# Altium schematic sheet Mechanical.SchDoc
size A4; SheetNumber: 2; SheetTotal: 3
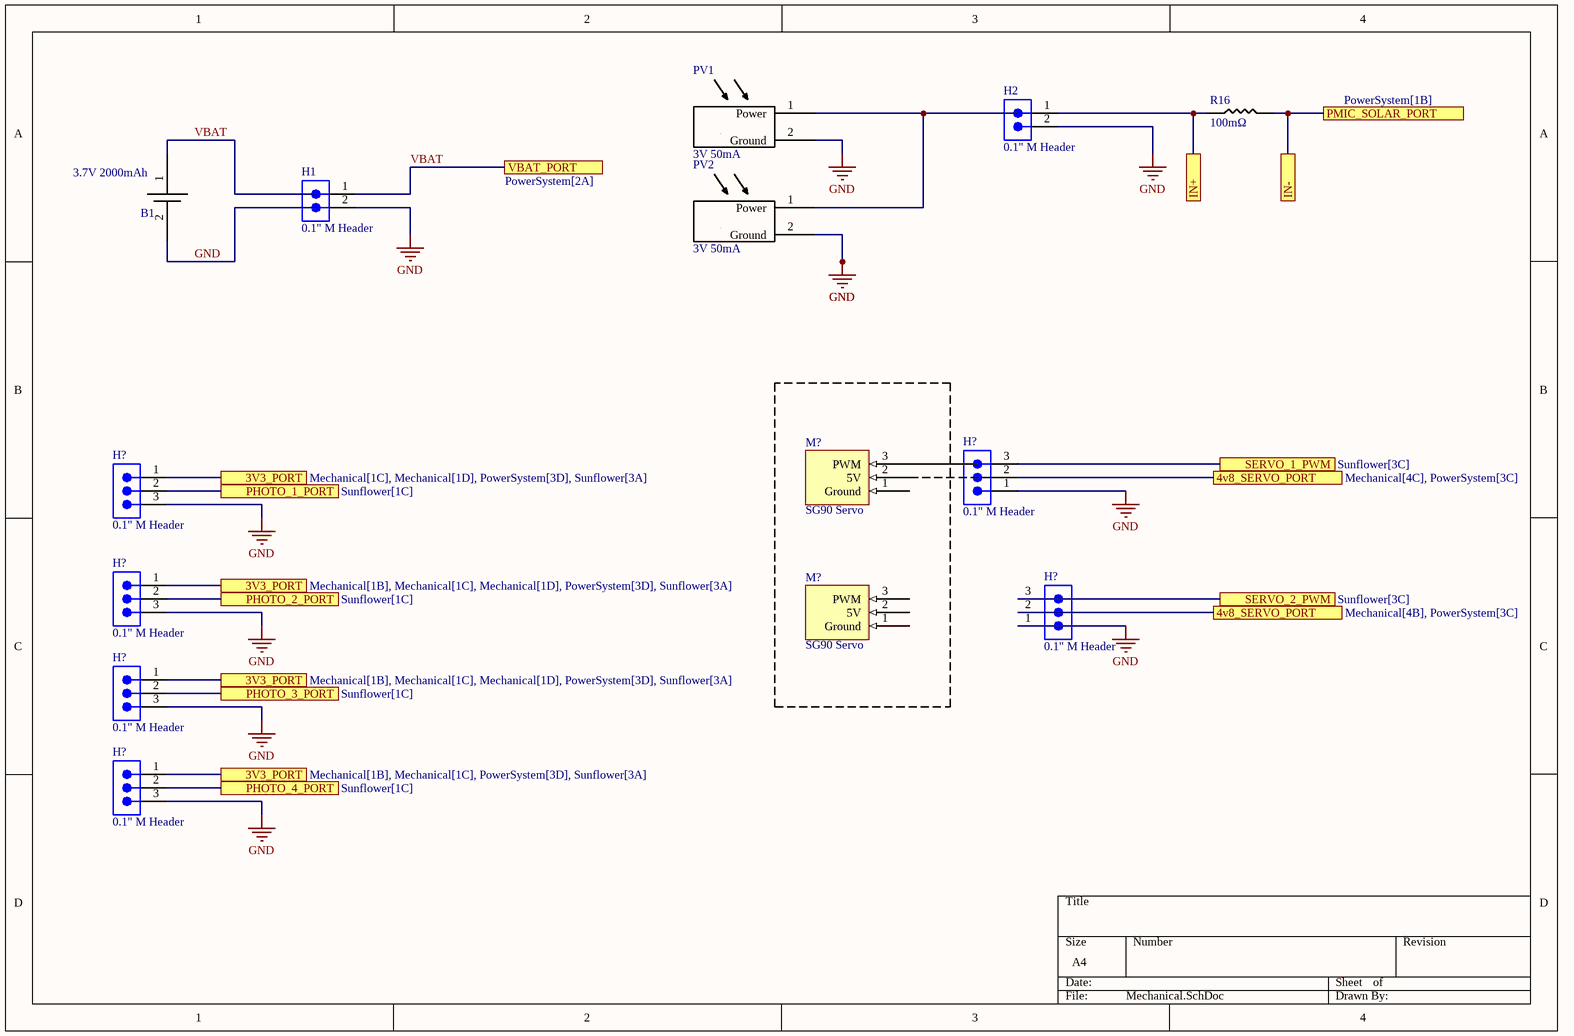
[diagram p0: Mechanical.SchDoc]

## Parts
(Parts that share a designator on the sheet are numbered #1, #2 ... from top to bottom, then left to right.)
B1  3.7V 2000mAh  [2_PIN_100MIL_BATTERY]
H1  0.1" M Header  [2_PIN_100MIL]
H2  0.1" M Header  [2_PIN_100MIL]
H?#1  0.1" M Header  [3_PIN_100mil_SERVO]
H?#2  0.1" M Header  [3_PIN_100mil_Photodiode]
H?#3  0.1" M Header  [3_PIN_100mil_Photodiode]
H?#4  0.1" M Header  [3_PIN_100mil_SERVO]
H?#5  0.1" M Header  [3_PIN_100mil_Photodiode]
H?#6  0.1" M Header  [3_PIN_100mil_Photodiode]
M?#1  SG90 Servo  [3_PIN_100mil_SERVO]  (mechanical)
M?#2  SG90 Servo  [3_PIN_100mil_SERVO]  (mechanical)
PV1  3V 50mA  [2_PIN_100MIL_SOLAR]
PV2  3V 50mA  [2_PIN_100MIL_SOLAR]
R16  value 100mΩ  [0603_Resistor]  (hidden comment: 0.1Ohm)

## Ports
3V3_PORT (see Mechanical[1B], Mechanical[1C], Mechanical[1D], PowerSystem[3D], Sunflower[3A]), 3V3_PORT (see Mechanical[1B], Mechanical[1C], PowerSystem[3D], Sunflower[3A]), 3V3_PORT (see Mechanical[1C], Mechanical[1D], PowerSystem[3D], Sunflower[3A]), 4v8_SERVO_PORT (see Mechanical[4B], PowerSystem[3C]), 4v8_SERVO_PORT (see Mechanical[4C], PowerSystem[3C]), IN+, IN-, PHOTO_1_PORT (see Sunflower[1C]), PHOTO_2_PORT (see Sunflower[1C]), PHOTO_3_PORT (see Sunflower[1C]), PHOTO_4_PORT (see Sunflower[1C]), PMIC_SOLAR_PORT (see PowerSystem[1B]), SERVO_1_PWM (see Sunflower[3C]), SERVO_2_PWM (see Sunflower[3C]), VBAT_PORT (see PowerSystem[2A])

## Nets
GND: B1.2(Ground) H1.2 H2.2 H?#1.1(PWM) H?#2.3 H?#3.3 H?#4.1(PWM) H?#5.3 H?#6.3 PV1.2(Ground) PV2.2(Ground)
3V3_PORT: H?#2.1 H?#3.1 H?#5.1 H?#6.1 ; port 3V3_PORT
4v8_SERVO_PORT: H?#1.2(Power) H?#4.2(Power) ; port 4v8_SERVO_PORT
IN+: H2.1 R16.1 ; port IN+
IN-: R16.2 ; port PMIC_SOLAR_PORT, port IN-
PHOTO_1_PORT: H?#2.2 ; port PHOTO_1_PORT
PHOTO_2_PORT: H?#3.2 ; port PHOTO_2_PORT
PHOTO_3_PORT: H?#5.2 ; port PHOTO_3_PORT
PHOTO_4_PORT: H?#6.2 ; port PHOTO_4_PORT
SERVO_1_PWM: H?#1.3(Ground) ; port SERVO_1_PWM
SERVO_2_PWM: H?#4.3(Ground) ; port SERVO_2_PWM
VBAT: B1.1(Power) H1.1 ; port VBAT_PORT
NetPV1_1: PV1.1(Power) PV2.1(Power)

Not connected (* = marked no-connect by the designer): M?#1 1(Ground) 2(5V) 3(PWM); M?#2 1(Ground) 2(5V) 3(PWM)

## Library data of the parts
B1 = 2011_Battery: Lithium Ion Battery - 3.7V 2000Mah Adafruit 2011; Manufacturer: Adafruit Industries; Manufacturer Part Number: 2011; Supplier: DigiKey; Supplier Part Number: 1528-1857-ND; Category: Batteries and Accessories; Stock: 51; Pricing: 1=12.5 (USD); RoHS: Non-Compliant; Schedule B: 8507600000|8507600000|8507600000|8507600000|8507600000
H1 = Battery_2Pin_100mil: CONN HEADER VERT 2POS 2.54MM; Manufacturer: Sullins; Manufacturer Part Number: PRPC002SAAN-RC; Connector Type: Header, Unshrouded, Breakaway; Number of Positions: 2; Number of Positions Loaded: All; Pitch: 0.100" (2.54mm); Online Catalog: 0.100" (2.54mm) Pitch Connector Headers; Other Names: S9510E-02  S9510E-02-ND; Supplier 1: Digi-Key; Stock 1: 42739; Pricing 1: 1=0.08, 10=0.073, 25=0.054, 50=0.0464, 100=0.0449, 250=0.0387, 500=0.0372 (USD); Standard Package: 1; Category: Connectors, Interconnects; Family: Rectangular Connectors - Headers, Male Pins; Series: -; Packaging: Bulk; Contact Type: Male Pin; Number of Rows: 1; Row Spacing: -; Contact Mating Length: 0.230" (5.84mm); Mounting Type: Through Hole; Termination: Solder; Fastening Type: -; Features: -; Contact Finish: Gold; Contact Finish Thickness: Flash; Color: Black; ComponentLink1URL: https://media.digikey.com/PDF/Data%20Sheets/Sullins%20PDFs/xRxCzzzSxxN-RC_ST_11635-B.pdf?src-supplier=Digi-Key; ComponentLink1Description: https://media.digikey.com/PDF/Data%20Sheets/Sullins%20PDFs/xRxCzzzSxxN-RC_ST_11635-B.pdf?src-supplier=Digi-Key; Supplier Part Number 1: S1011EC-02-ND
H2 = Solar_2Pin_100mil: CONN HEADER VERT 2POS 2.54MM; Manufacturer: Sullins; Manufacturer Part Number: PRPC002SAAN-RC; Connector Type: Header, Unshrouded, Breakaway; Number of Positions: 2; Number of Positions Loaded: All; Pitch: 0.100" (2.54mm); Online Catalog: 0.100" (2.54mm) Pitch Connector Headers; Other Names: S9510E-02  S9510E-02-ND; Supplier 1: Digi-Key; Stock 1: 42739; Pricing 1: 1=0.08, 10=0.073, 25=0.054, 50=0.0464, 100=0.0449, 250=0.0387, 500=0.0372 (USD); Standard Package: 1; Category: Connectors, Interconnects; Family: Rectangular Connectors - Headers, Male Pins; Series: -; Packaging: Bulk; Contact Type: Male Pin; Number of Rows: 1; Row Spacing: -; Contact Mating Length: 0.230" (5.84mm); Mounting Type: Through Hole; Termination: Solder; Fastening Type: -; Features: -; Contact Finish: Gold; Contact Finish Thickness: Flash; Color: Black; ComponentLink1URL: https://media.digikey.com/PDF/Data%20Sheets/Sullins%20PDFs/xRxCzzzSxxN-RC_ST_11635-B.pdf?src-supplier=Digi-Key; ComponentLink1Description: https://media.digikey.com/PDF/Data%20Sheets/Sullins%20PDFs/xRxCzzzSxxN-RC_ST_11635-B.pdf?src-supplier=Digi-Key; Supplier Part Number 1: S1011EC-02-ND
H?#1 H?#4 = Servo_3Pin_100mil: CONN HEADER VERT 3POS 2.54MM; Manufacturer: Sullins; Manufacturer Part Number: PRPC003SAAN-RC; Connector Type: Header, Unshrouded, Breakaway; Number of Positions: 3; Number of Positions Loaded: All; Pitch: 0.100" (2.54mm); Online Catalog: 0.100" (2.54mm) Pitch Connector Headers; Other Names: S9510E-03  S9510E-03-ND; Supplier 1: Digi-Key; Stock 1: 19067; Pricing 1: 1=0.12, 10=0.109, 25=0.0812, 50=0.0696, 100=0.0673, 250=0.058, 500=0.0557 (USD); Standard Package: 1; Category: Connectors, Interconnects; Family: Rectangular Connectors - Headers, Male Pins; Series: -; Packaging: Bulk; Contact Type: Male Pin; Number of Rows: 1; Row Spacing: -; Contact Mating Length: 0.230" (5.84mm); Mounting Type: Through Hole; Termination: Solder; Fastening Type: -; Features: -; Contact Finish: Gold; Contact Finish Thickness: Flash; Color: Black; ComponentLink1URL: https://media.digikey.com/PDF/Data%20Sheets/Sullins%20PDFs/xRxCzzzSxxN-RC_ST_11635-B.pdf?src-supplier=Digi-Key; ComponentLink1Description: https://media.digikey.com/PDF/Data%20Sheets/Sullins%20PDFs/xRxCzzzSxxN-RC_ST_11635-B.pdf?src-supplier=Digi-Key; Supplier Part Number 1: S1011EC-03-ND
H?#2 H?#3 H?#5 H?#6 = Photodiode_3Pin_100mil: CONN HEADER VERT 3POS 2.54MM; Manufacturer: Sullins; Manufacturer Part Number: PRPC003SAAN-RC; Connector Type: Header, Unshrouded, Breakaway; Number of Positions: 3; Number of Positions Loaded: All; Pitch: 0.100" (2.54mm); Online Catalog: 0.100" (2.54mm) Pitch Connector Headers; Other Names: S9510E-03  S9510E-03-ND; Supplier 1: Digi-Key; Stock 1: 19067; Pricing 1: 1=0.12, 10=0.109, 25=0.0812, 50=0.0696, 100=0.0673, 250=0.058, 500=0.0557 (USD); Standard Package: 1; Category: Connectors, Interconnects; Family: Rectangular Connectors - Headers, Male Pins; Series: -; Packaging: Bulk; Contact Type: Male Pin; Number of Rows: 1; Row Spacing: -; Contact Mating Length: 0.230" (5.84mm); Mounting Type: Through Hole; Termination: Solder; Fastening Type: -; Features: -; Contact Finish: Gold; Contact Finish Thickness: Flash; Color: Black; ComponentLink1URL: https://media.digikey.com/PDF/Data%20Sheets/Sullins%20PDFs/xRxCzzzSxxN-RC_ST_11635-B.pdf?src-supplier=Digi-Key; ComponentLink1Description: https://media.digikey.com/PDF/Data%20Sheets/Sullins%20PDFs/xRxCzzzSxxN-RC_ST_11635-B.pdf?src-supplier=Digi-Key; Supplier Part Number 1: S1011EC-03-ND
M?#1 M?#2 = SG90
PV1 PV2 = MP3-37: Flexible Thin Film Solar Module 3.0V @ 50mA; Manufacturer: PowerFilm; Supplier: DigiKey; Supplier Part Number: 1996-1024-ND; Manufacturer Part Number: MP3-37; Category: Sensors; Stock: 47; Pricing: 1=8.47, 10=6.927, 50=6.0358, 100=5.6918, 300=5.18977, 500=4.97292, 1000=4.69426 (USD); Case/Package: Module; RoHS: Non-Compliant; ComponentLink1URL: https://datasheet.octopart.com:443/MP3-37-PowerFilm-datasheet-13541941.pdf?src-supplier=Jameco+(USA); ComponentLink1Description: https://datasheet.octopart.com:443/MP3-37-PowerFilm-datasheet-13541941.pdf?src-supplier=Jameco+(USA)
R16 = R_0603_0.1Ohm: Res Thick Film 0603 0.1 Ohm 1% 0.25W ±300ppm/°C Molded SMD Punched Carrier T/R; Manufacturer: Panasonic; Manufacturer Part Number: ERJ3BSFR10V; Manufacturer Lifecycle Status: ACTIVE; Part Series: Current Sensing Resistors Thick Film Type; Max Power Dissipation: 250mW; Working Voltage: 158.1mV; Supplier: DigiKey; Supplier Part Number: P17447CT-ND; RoHS: Compliant; Category: Chip SMD Resistors; Stock: 26179; Pricing: 1=0.37, 10=0.204, 25=0.1668, 50=0.1458, 100=0.129, 250=0.11208, 500=0.1023, 1000=0.09455 (USD); Case/Package: 0603; Case Code (Imperial): 0603; Case Code (Metric): 1608; Composition: Thick Film; Contact Plating: Tin; Country of Origin: Japan; Depth: 800µm; Export Control Classification Number (ECCN) Code: EAR99; Features: Automotive AEC-Q200; Height: 450µm; Harmonized Tariff Schedule (HTS) Code: 8533.21.00.30; Introduction Date: 2006-01-31; Length: 1.6mm; Lifecycle Status: Production; Max Operating Temperature: 155°C; Military Standard: Not; Min Operating Temperature: -55°C; Mounting Technology: Surface Mount; Pins: 2; Number of Terminals: 2; Number of Terminations: 2; Packaging: Cut Tape; Power Rating: 250mW; Radiation Hardening: No; Ratings: AEC-Q200; REACH SVHC: Unaffected; Schedule B: 8533210045, 8533210045|8533210045, 8533210045|8533210045|8533210045, 8533210045|8533210045|8533210045|8533210045; Temperature Coefficient: 300ppm/°C; Termination: SMD/SMT; Tolerance: 1%; Width: 800µm; ComponentLink1URL: https://datasheet.octopart.com:443/ERJ3BSFR10V-Panasonic-datasheet-175421125.pdf?src-supplier=IHS; ComponentLink1Description: https://datasheet.octopart.com:443/ERJ3BSFR10V-Panasonic-datasheet-175421125.pdf?src-supplier=IHS; ComponentLink2URL: https://datasheet.octopart.com:443/ERJ3BSFR10V-Panasonic-datasheet-68299093.pdf?src-supplier=Future+Electronics; ComponentLink2Description: https://datasheet.octopart.com:443/ERJ3BSFR10V-Panasonic-datasheet-68299093.pdf?src-supplier=Future+Electronics; ComponentLink3URL: https://datasheet.octopart.com:443/ERJ-3BSFR10V-Panasonic-datasheet-118180696.pdf?src-supplier=Future+Electronics; ComponentLink3Description: https://datasheet.octopart.com:443/ERJ-3BSFR10V-Panasonic-datasheet-118180696.pdf?src-supplier=Future+Electronics; ComponentLink4URL: https://datasheet.octopart.com:443/ERJ-3BSFR10V-Panasonic-datasheet-154766170.pdf?src-supplier=JRH+Electronics; ComponentLink4Description: https://datasheet.octopart.com:443/ERJ-3BSFR10V-Panasonic-datasheet-154766170.pdf?src-supplier=JRH+Electronics; ComponentLink5URL: https://datasheet.octopart.com:443/ERJ3BSFR10V-Panasonic-datasheet-136473239.pdf?src-supplier=Newark; ComponentLink5Description: https://datasheet.octopart.com:443/ERJ3BSFR10V-Panasonic-datasheet-136473239.pdf?src-supplier=Newark; ComponentLink6URL: https://datasheet.octopart.com:443/ERJ3BSFR10V-Panasonic-datasheet-62346600.pdf?src-supplier=Newark; ComponentLink6Description: https://datasheet.octopart.com:443/ERJ3BSFR10V-Panasonic-datasheet-62346600.pdf?src-supplier=Newark; ComponentLink7URL: https://datasheet.octopart.com:443/ERJ3BSFR10V-Panasonic-datasheet-10033053.pdf?src-supplier=Newark; ComponentLink7Description: https://datasheet.octopart.com:443/ERJ3BSFR10V-Panasonic-datasheet-10033053.pdf?src-supplier=Newark; ComponentLink8URL: https://datasheet.octopart.com:443/ERJ3BSFR10V-Panasonic-datasheet-41172793.pdf?src-supplier=Newark; ComponentLink8Description: https://datasheet.octopart.com:443/ERJ3BSFR10V-Panasonic-datasheet-41172793.pdf?src-supplier=Newark; ComponentLink9URL: https://datasheet.octopart.com:443/ERJ3BSFR10V-Panasonic-datasheet-170667598.pdf?src-supplier=TME; ComponentLink9Description: https://datasheet.octopart.com:443/ERJ3BSFR10V-Panasonic-datasheet-170667598.pdf?src-supplier=TME; ComponentLink10URL: https://datasheet.octopart.com:443/ERJ3BSFR10V-Panasonic-datasheet-164871471.pdf?src-supplier=Burklin+Elektronik; ComponentLink10Description: https://datasheet.octopart.com:443/ERJ3BSFR10V-Panasonic-datasheet-164871471.pdf?src-supplier=Burklin+Elektronik; ComponentLink11URL: https://datasheet.octopart.com:443/ERJ-3BSFR10V-Panasonic-datasheet-15994758.pdf?src-supplier=Farnell; ComponentLink11Description: https://datasheet.octopart.com:443/ERJ-3BSFR10V-Panasonic-datasheet-15994758.pdf?src-supplier=Farnell; ComponentLink12URL: https://datasheet.octopart.com:443/ERJ-3BSFR10V-Panasonic-datasheet-13271236.pdf?src-supplier=Electro+Sonic; ComponentLink12Description: https://datasheet.octopart.com:443/ERJ-3BSFR10V-Panasonic-datasheet-13271236.pdf?src-supplier=Electro+Sonic; ComponentLink13URL: https://datasheet.octopart.com:443/ERJ-3BSFR10V-Panasonic-datasheet-22087634.pdf?src-supplier=Electro+Sonic; ComponentLink13Description: https://datasheet.octopart.com:443/ERJ-3BSFR10V-Panasonic-datasheet-22087634.pdf?src-supplier=Electro+Sonic; Digikey Part Number: P17447CT-ND